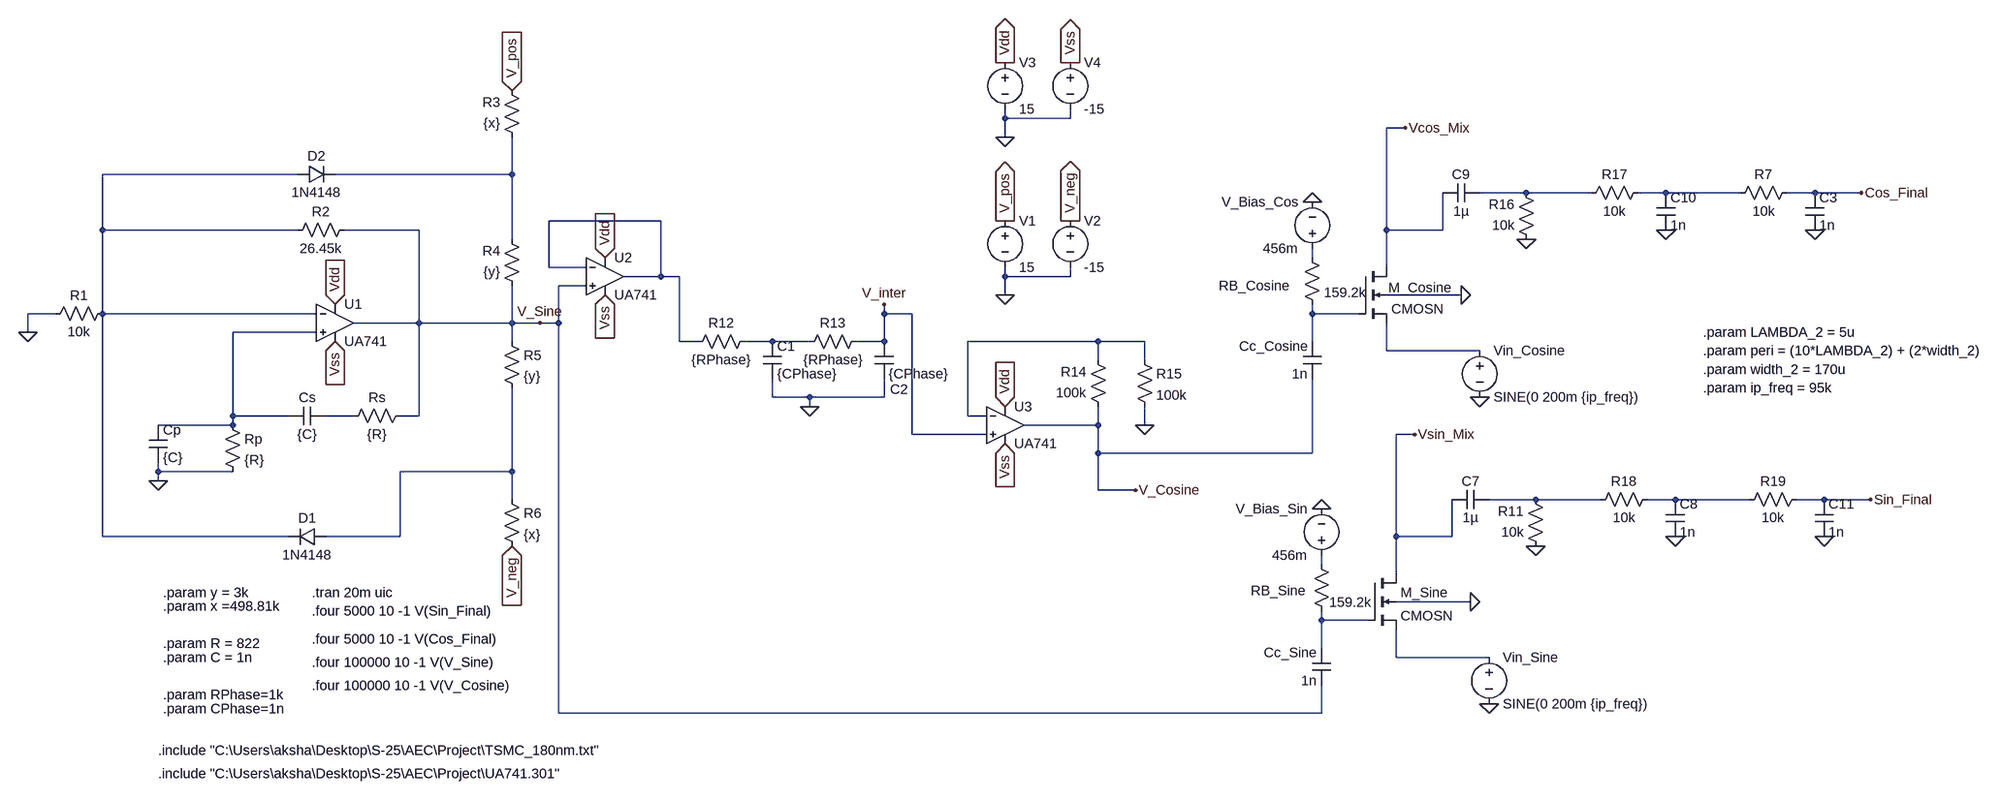
[diagram p0: schematic Old_Proj_Final_4.asc]
Old_Proj_Final_4.asc, the LTspice schematic file:
Version 4
SHEET 1 4372 964
WIRE 1872 -624 1872 -640
WIRE 1984 -624 1984 -640
WIRE 1984 -624 1872 -624
WIRE 2560 -608 2528 -608
WIRE 1872 -592 1872 -624
WIRE 656 -528 320 -528
WIRE 1024 -528 1024 -592
WIRE 1024 -528 720 -528
WIRE 2768 -496 2688 -496
WIRE 2880 -496 2768 -496
WIRE 3008 -496 2960 -496
WIRE 3136 -496 3008 -496
WIRE 3264 -496 3216 -496
WIRE 3344 -496 3264 -496
WIRE 1280 -448 1088 -448
WIRE 320 -432 320 -528
WIRE 656 -432 320 -432
WIRE 864 -432 736 -432
WIRE 2528 -432 2528 -608
WIRE 2624 -432 2624 -496
WIRE 2624 -432 2528 -432
WIRE 1024 -416 1024 -528
WIRE 2400 -384 2400 -400
WIRE 1088 -368 1088 -448
WIRE 1152 -368 1088 -368
WIRE 2528 -368 2528 -432
WIRE 1280 -352 1280 -448
WIRE 1280 -352 1216 -352
WIRE 1312 -352 1280 -352
WIRE 1872 -352 1872 -368
WIRE 1984 -352 1984 -368
WIRE 1984 -352 1872 -352
WIRE 1152 -336 1104 -336
WIRE 1872 -320 1872 -352
WIRE 2656 -320 2528 -320
WIRE 240 -288 192 -288
WIRE 320 -288 320 -432
WIRE 688 -288 320 -288
WIRE 1664 -288 1664 -304
WIRE 1712 -288 1664 -288
WIRE 2400 -288 2400 -304
WIRE 2480 -288 2400 -288
WIRE 864 -272 864 -432
WIRE 864 -272 752 -272
WIRE 1024 -272 1024 -336
WIRE 1024 -272 864 -272
WIRE 1072 -272 1024 -272
WIRE 1104 -272 1104 -336
WIRE 1104 -272 1072 -272
WIRE 192 -256 192 -288
WIRE 688 -256 544 -256
WIRE 1024 -240 1024 -272
WIRE 1312 -240 1312 -352
WIRE 1344 -240 1312 -240
WIRE 1472 -240 1424 -240
WIRE 1536 -240 1472 -240
WIRE 1664 -240 1664 -288
WIRE 1664 -240 1616 -240
WIRE 2032 -240 1808 -240
WIRE 2112 -240 2032 -240
WIRE 2400 -240 2400 -288
WIRE 2528 -224 2528 -272
WIRE 2688 -224 2528 -224
WIRE 2032 -208 2032 -240
WIRE 2112 -208 2112 -240
WIRE 1472 -144 1472 -176
WIRE 1536 -144 1472 -144
WIRE 1664 -144 1664 -176
WIRE 1664 -144 1536 -144
WIRE 1536 -128 1536 -144
WIRE 544 -112 544 -256
WIRE 640 -112 544 -112
WIRE 752 -112 704 -112
WIRE 864 -112 864 -272
WIRE 864 -112 832 -112
WIRE 1808 -112 1808 -240
WIRE 1840 -112 1808 -112
WIRE 544 -96 544 -112
WIRE 544 -96 416 -96
WIRE 2032 -96 2032 -128
WIRE 2032 -96 1904 -96
WIRE 2112 -96 2112 -128
WIRE 1712 -80 1712 -288
WIRE 1840 -80 1712 -80
WIRE 2576 -80 2544 -80
WIRE 2032 -48 2032 -96
WIRE 2400 -48 2400 -176
WIRE 2400 -48 2032 -48
WIRE 416 -16 416 -32
WIRE 544 -16 416 -16
WIRE 1024 -16 1024 -160
WIRE 1024 -16 832 -16
WIRE 416 0 416 -16
WIRE 2032 16 2032 -48
WIRE 2096 16 2032 16
WIRE 1024 32 1024 -16
WIRE 2784 32 2704 32
WIRE 2896 32 2784 32
WIRE 3024 32 2976 32
WIRE 3152 32 3024 32
WIRE 3280 32 3232 32
WIRE 3360 32 3280 32
WIRE 320 96 320 -288
WIRE 640 96 320 96
WIRE 832 96 832 -16
WIRE 832 96 704 96
WIRE 2544 96 2544 -80
WIRE 2640 96 2640 32
WIRE 2640 96 2544 96
WIRE 2416 144 2416 128
WIRE 2544 160 2544 96
WIRE 2672 208 2544 208
WIRE 2416 240 2416 224
WIRE 2496 240 2416 240
WIRE 2416 288 2416 240
WIRE 2544 304 2544 256
WIRE 2704 304 2544 304
WIRE 1104 400 1104 -272
WIRE 2416 400 2416 352
WIRE 2416 400 1104 400
FLAG 1872 -320 0
FLAG 1872 -448 V_pos
IOPIN 1872 -448 Out
FLAG 1984 -448 V_neg
IOPIN 1984 -448 Out
FLAG 1872 -592 0
FLAG 1872 -720 Vdd
IOPIN 1872 -720 Out
FLAG 1984 -720 Vss
IOPIN 1984 -720 Out
FLAG 720 -304 Vdd
IOPIN 720 -304 In
FLAG 720 -240 Vss
IOPIN 720 -240 In
FLAG 1024 -672 V_pos
IOPIN 1024 -672 In
FLAG 1024 112 V_neg
IOPIN 1024 112 In
FLAG 416 0 0
FLAG 192 -256 0
FLAG 1072 -272 V_Sine
FLAG 1536 -128 0
FLAG 1872 -128 Vdd
IOPIN 1872 -128 In
FLAG 1872 -64 Vss
IOPIN 1872 -64 In
FLAG 2096 16 V_Cosine
FLAG 2112 -96 0
FLAG 1184 -384 Vdd
IOPIN 1184 -384 In
FLAG 1184 -320 Vss
IOPIN 1184 -320 In
FLAG 1664 -304 V_inter
FLAG 2416 48 0
FLAG 2704 384 0
FLAG 2672 208 0
FLAG 2400 -480 0
FLAG 2688 -144 0
FLAG 2656 -320 0
FLAG 2560 -608 Vcos_Mix
FLAG 3344 -496 Cos_Final
FLAG 3008 -432 0
FLAG 2768 -416 0
FLAG 3264 -432 0
FLAG 2576 -80 Vsin_Mix
FLAG 3360 32 Sin_Final
FLAG 3024 96 0
FLAG 2784 112 0
FLAG 3280 96 0
SYMBOL OpAmps\\opamp2 720 -336 R0
SYMATTR InstName U1
SYMATTR Value UA741
SYMBOL voltage 1872 -464 R0
WINDOW 123 0 0 Left 0
WINDOW 39 0 0 Left 0
SYMATTR InstName V1
SYMATTR Value 15
SYMBOL voltage 1984 -464 R0
WINDOW 123 0 0 Left 0
WINDOW 39 0 0 Left 0
SYMATTR InstName V2
SYMATTR Value -15
SYMBOL voltage 1872 -736 R0
WINDOW 123 0 0 Left 0
WINDOW 39 0 0 Left 0
SYMATTR InstName V3
SYMATTR Value 15
SYMBOL voltage 1984 -736 R0
WINDOW 123 0 0 Left 0
WINDOW 39 0 0 Left 0
SYMATTR InstName V4
SYMATTR Value -15
SYMBOL cap 400 -96 R0
SYMATTR InstName Cp
SYMATTR Value {C}
SYMBOL cap 704 -128 R90
WINDOW 0 0 32 VBottom 2
WINDOW 3 32 32 VTop 2
SYMATTR InstName Cs
SYMATTR Value {C}
SYMBOL res 528 -112 R0
SYMATTR InstName Rp
SYMATTR Value {R}
SYMBOL res 848 -128 R90
WINDOW 0 0 56 VBottom 2
WINDOW 3 32 56 VTop 2
SYMATTR InstName Rs
SYMATTR Value {R}
SYMBOL res 752 -448 R90
WINDOW 0 0 56 VBottom 2
WINDOW 3 32 56 VTop 2
SYMATTR InstName R2
SYMATTR Value 26.45k
SYMBOL res 336 -304 R90
WINDOW 0 0 56 VBottom 2
WINDOW 3 32 56 VTop 2
SYMATTR InstName R1
SYMATTR Value 10k
SYMBOL res 1040 -320 R180
WINDOW 0 36 76 Left 2
WINDOW 3 36 40 Left 2
SYMATTR InstName R4
SYMATTR Value {y}
SYMBOL res 1040 -576 R180
WINDOW 0 36 76 Left 2
WINDOW 3 36 40 Left 2
SYMATTR InstName R3
SYMATTR Value {x}
SYMBOL res 1008 -256 R0
SYMATTR InstName R5
SYMATTR Value {y}
SYMBOL res 1008 16 R0
SYMATTR InstName R6
SYMATTR Value {x}
SYMBOL diode 704 80 R90
WINDOW 0 0 32 VBottom 2
WINDOW 3 32 32 VTop 2
SYMATTR InstName D1
SYMATTR Value 1N4148
SYMBOL diode 656 -512 R270
WINDOW 0 32 32 VTop 2
WINDOW 3 0 32 VBottom 2
SYMATTR InstName D2
SYMATTR Value 1N4148
SYMBOL res 1440 -256 R90
WINDOW 0 0 56 VBottom 2
WINDOW 3 32 56 VTop 2
SYMATTR InstName R12
SYMATTR Value {RPhase}
SYMBOL res 1632 -256 R90
WINDOW 0 0 56 VBottom 2
WINDOW 3 32 56 VTop 2
SYMATTR InstName R13
SYMATTR Value {RPhase}
SYMBOL cap 1456 -240 R0
SYMATTR InstName C1
SYMATTR Value {CPhase}
SYMBOL cap 1648 -240 R0
WINDOW 0 26 82 Left 2
SYMATTR InstName C2
SYMATTR Value {CPhase}
SYMBOL OpAmps\\opamp2 1872 -160 R0
SYMATTR InstName U3
SYMATTR Value UA741
SYMBOL res 2048 -112 R180
WINDOW 0 36 76 Left 2
WINDOW 3 36 40 Left 2
SYMATTR InstName R14
SYMATTR Value 100k
SYMBOL res 2096 -224 R0
SYMATTR InstName R15
SYMATTR Value 100k
SYMBOL OpAmps\\opamp2 1184 -416 R0
SYMATTR InstName U2
SYMATTR Value UA741
SYMBOL cap 2432 352 R180
WINDOW 0 24 56 Left 2
WINDOW 3 24 8 Left 2
SYMATTR InstName Cc_Sine
SYMATTR Value 1n
SYMBOL res 2400 128 R0
WINDOW 0 -106 61 Left 2
WINDOW 3 29 81 Left 2
SYMATTR InstName RB_Sine
SYMATTR Value 159.2k
SYMBOL voltage 2416 144 R180
WINDOW 0 24 96 Left 2
WINDOW 3 24 16 Left 2
WINDOW 123 0 0 Left 0
WINDOW 39 0 0 Left 0
SYMATTR InstName V_Bias_Sin
SYMATTR Value 456m
SYMBOL nmos4 2496 160 R0
SYMATTR InstName M_Sine
SYMATTR Value CMOSN
SYMATTR Value2 l={2*LAMBDA_2} w={1*width_2} ad={5*width_2*LAMBDA_2} as={5*width_2*LAMBDA_2} pd={peri} ps={peri}
SYMBOL voltage 2704 288 R0
WINDOW 123 0 0 Left 0
WINDOW 39 0 0 Left 0
SYMATTR InstName Vin_Sine
SYMATTR Value SINE(0 200m {ip_freq})
SYMBOL cap 2416 -176 R180
WINDOW 0 24 56 Left 2
WINDOW 3 24 8 Left 2
SYMATTR InstName Cc_Cosine
SYMATTR Value 1n
SYMBOL res 2384 -400 R0
WINDOW 0 -145 64 Left 2
SYMATTR InstName RB_Cosine
SYMATTR Value 159.2k
SYMBOL voltage 2400 -384 R180
WINDOW 0 24 96 Left 2
WINDOW 3 24 16 Left 2
WINDOW 123 0 0 Left 0
WINDOW 39 0 0 Left 0
SYMATTR InstName V_Bias_Cos
SYMATTR Value 456m
SYMBOL nmos4 2480 -368 R0
WINDOW 0 51 35 Left 2
SYMATTR InstName M_Cosine
SYMATTR Value CMOSN
SYMATTR Value2 l={2*LAMBDA_2} w={1*width_2} ad={5*width_2*LAMBDA_2} as={5*width_2*LAMBDA_2} pd={peri} ps={peri}
SYMBOL voltage 2688 -240 R0
WINDOW 123 0 0 Left 0
WINDOW 39 0 0 Left 0
SYMATTR InstName Vin_Cosine
SYMATTR Value SINE(0 200m {ip_freq})
SYMBOL res 2784 -400 R180
WINDOW 0 36 76 Left 2
WINDOW 3 36 40 Left 2
SYMATTR InstName R16
SYMATTR Value 10k
SYMBOL cap 2688 -512 R90
WINDOW 0 0 32 VBottom 2
WINDOW 3 32 32 VTop 2
SYMATTR InstName C9
SYMATTR Value 1µ
SYMBOL res 2976 -512 R90
WINDOW 0 0 56 VBottom 2
WINDOW 3 32 56 VTop 2
SYMATTR InstName R17
SYMATTR Value 10k
SYMBOL cap 2992 -496 R0
SYMATTR InstName C10
SYMATTR Value 1n
SYMBOL res 3232 -512 R90
WINDOW 0 0 56 VBottom 2
WINDOW 3 32 56 VTop 2
SYMATTR InstName R7
SYMATTR Value 10k
SYMBOL cap 3248 -496 R0
SYMATTR InstName C3
SYMATTR Value 1n
SYMBOL res 2800 128 R180
WINDOW 0 36 76 Left 2
WINDOW 3 36 40 Left 2
SYMATTR InstName R11
SYMATTR Value 10k
SYMBOL cap 2704 16 R90
WINDOW 0 0 32 VBottom 2
WINDOW 3 32 32 VTop 2
SYMATTR InstName C7
SYMATTR Value 1µ
SYMBOL res 2992 16 R90
WINDOW 0 0 56 VBottom 2
WINDOW 3 32 56 VTop 2
SYMATTR InstName R18
SYMATTR Value 10k
SYMBOL cap 3008 32 R0
SYMATTR InstName C8
SYMATTR Value 1n
SYMBOL res 3248 16 R90
WINDOW 0 0 56 VBottom 2
WINDOW 3 32 56 VTop 2
SYMATTR InstName R19
SYMATTR Value 10k
SYMBOL cap 3264 32 R0
SYMATTR InstName C11
SYMATTR Value 1n
TEXT 416 464 Left 2 !.include "C:\\Users\\aksha\\Desktop\\S-25\\AEC\\Project\\TSMC_180nm.txt"
TEXT 680 312 Left 2 !.four 100000 10 -1 V(V_Sine)
TEXT 424 192 Left 2 !.param y = 3k
TEXT 424 216 Left 2 !.param x =498.81k
TEXT 424 280 Left 2 !.param R = 822
TEXT 424 304 Left 2 !.param C = 1n
TEXT 680 192 Left 2 !.tran 20m uic
TEXT 680 352 Left 2 !.four 100000 10 -1 V(V_Cosine)
TEXT 424 368 Left 2 !.param RPhase=1k
TEXT 424 392 Left 2 !.param CPhase=1n
TEXT 416 504 Left 2 !.include "C:\\Users\\aksha\\Desktop\\S-25\\AEC\\Project\\UA741.301"
TEXT 3072 -224 Left 2 !.param peri = (10*LAMBDA_2) + (2*width_2)
TEXT 3072 -256 Left 2 !.param LAMBDA_2 = 5u
TEXT 3072 -192 Left 2 !.param width_2 = 170u
TEXT 3072 -160 Left 2 !.param ip_freq = 95k
TEXT 680 272 Left 2 !.four 5000 10 -1 V(Cos_Final)
TEXT 680 224 Left 2 !.four 5000 10 -1 V(Sin_Final)

The netlist it stands for:
* Old_Proj_Final_4.asc
XU1 N008 N001 Vdd Vss V_Sine UA741  ; pins In+ In- V+ V- OUT
V1 V_pos 0 15
V2 V_neg 0 -15
V3 Vdd 0 15
V4 Vss 0 -15
Cp N008 0 {C}
Cs N012 N008 {C}
Rp N008 0 {R}
Rs V_Sine N012 {R}
R2 V_Sine N001 26.45k
R1 N001 0 10k
R4 V_Sine N002 {y}
R3 N002 V_pos {x}
R5 V_Sine N013 {y}
R6 N013 V_neg {x}
D1 N013 N001 1N4148
D2 N001 N002 1N4148
R12 N009 N005 {RPhase}
R13 V_inter N009 {RPhase}
C1 N009 0 {CPhase}
C2 V_inter 0 {CPhase}
XU3 V_inter N010 Vdd Vss V_Cosine UA741  ; pins In+ In- V+ V- OUT
R14 V_Cosine N010 100k
R15 N010 0 100k
XU2 V_Sine N005 Vdd Vss N005 UA741  ; pins In+ In- V+ V- OUT
Cc_Sine V_Sine N017 1n
RB_Sine N016 N017 159.2k
V_Bias_Sin N016 0 456m
M_Sine Vsin_Mix N017 N018 0 CMOSN l={2*LAMBDA_2} w={1*width_2} ad={5*width_2*LAMBDA_2} as={5*width_2*LAMBDA_2} pd={peri} ps={peri}
Vin_Sine N018 0 SINE(0 200m {ip_freq})
Cc_Cosine V_Cosine N007 1n
RB_Cosine N006 N007 159.2k
V_Bias_Cos N006 0 456m
M_Cosine Vcos_Mix N007 N011 0 CMOSN l={2*LAMBDA_2} w={1*width_2} ad={5*width_2*LAMBDA_2} as={5*width_2*LAMBDA_2} pd={peri} ps={peri}
Vin_Cosine N011 0 SINE(0 200m {ip_freq})
R16 0 N003 10k
C9 N003 Vcos_Mix 1µ
R17 N004 N003 10k
C10 N004 0 1n
R7 Cos_Final N004 10k
C3 Cos_Final 0 1n
R11 0 N014 10k
C7 N014 Vsin_Mix 1µ
R18 N015 N014 10k
C8 N015 0 1n
R19 Sin_Final N015 10k
C11 Sin_Final 0 1n
.model D D
.lib standard.dio
.model NMOS NMOS
.model PMOS PMOS
.lib standard.mos
.include "C:\Users\aksha\Desktop\S-25\AEC\Project\TSMC_180nm.txt"
.four 100000 10 -1 V(V_Sine)
.param y = 3k
.param x =498.81k
.param R = 822
.param C = 1n
.tran 20m uic
.four 100000 10 -1 V(V_Cosine)
.param RPhase=1k
.param CPhase=1n
.include "C:\Users\aksha\Desktop\S-25\AEC\Project\UA741.301"
.param peri = (10*LAMBDA_2) + (2*width_2)
.param LAMBDA_2 = 5u
.param width_2 = 170u
.param ip_freq = 95k
.four 5000 10 -1 V(Cos_Final)
.four 5000 10 -1 V(Sin_Final)
.backanno
.end